# EAGLE design tiny_stella (EAGLE 9.1.3)
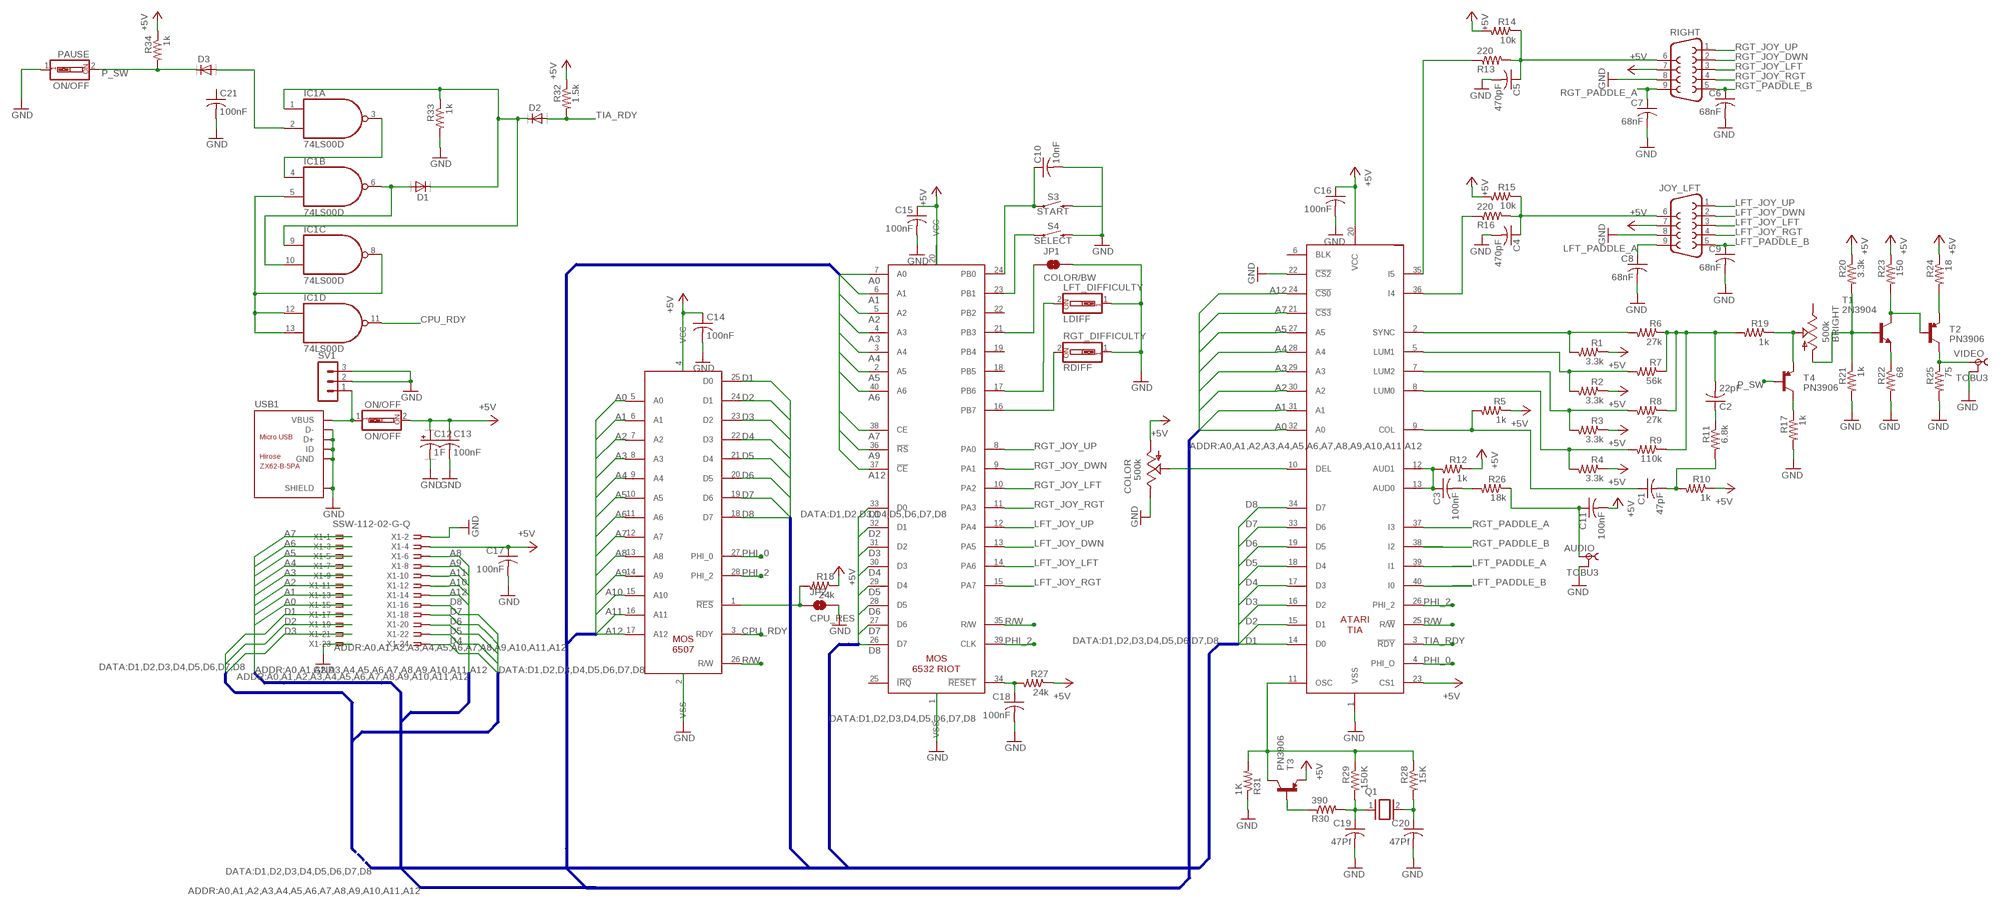
[diagram p0: schematic, sheet 1]

## Parts
6507  MOS_6507  [DIL28]
6532  MOS_6532  [DIL40]
AUDIO  TOBU3  [TOBU3]
BRIGHT  500k  TRIM_US-3223G  [3223G]
C1  47pF  C-USC0805  [C0805]
C2  22pF  C-USC0805  [C0805]
C3  100nF  C-USC0805  [C0805]
C4  470pF  C-USC0805  [C0805]
C5  470pF  C-USC0805  [C0805]
C6  68nF  C-USC0805  [C0805]
C7  68nF  C-USC0805  [C0805]
C8  68nF  C-USC0805  [C0805]
C9  68nF  C-USC0805  [C0805]
C10  10nF  C-USC0805  [C0805]
C11  100nF  C-USC0805  [C0805]
C12  1F  CPOL-USE3.5-8  [E3,5-8]
C13  100nF  C-USC0805  [C0805]
C14  100nF  C-USC0805  [C0805]
C15  100nF  C-USC0805  [C0805]
C16  100nF  C-USC0805  [C0805]
C17  100nF  C-USC0805  [C0805]
C18  100nF  C-USC0805  [C0805]
C19  47Pf  C-USC0805  [C0805]
C20  47Pf  C-USC0805  [C0805]
C21  100nF  C-USC0805  [C0805]
COLOR  500k  TRIM_US-3223G  [3223G]
D1  DIODE_E-  [DIODE_SMB]
D2  DIODE_E-  [DIODE_SMB]
D3  DIODE_E-  [DIODE_SMB]
IC1  74LS00D  [SO14]
JOY_LFT  F09HP  [F09HP]
JP1  COLOR/BW  JUMPER-SMT_2_NO_NO-SILK  [SMT-JUMPER_2_NO_NO-SILK]
JP2  CPU_RES  JUMPER-SMT_2_NO_NO-SILK  [SMT-JUMPER_2_NO_NO-SILK]
LDIFF  LFT_DIFFICULTY  SW_DIP-1  [EDG-01]
ON/OFF  ON/OFF  SW_DIP-1  [EDG-01]
PAUSE  ON/OFF  SW_DIP-1  [EDG-01]
Q1  XTAL/S  [QS]
R1  3.3k  R-US_M0805  [M0805]
R2  3.3k  R-US_M0805  [M0805]
R3  3.3k  R-US_M0805  [M0805]
R4  3.3k  R-US_M0805  [M0805]
R5  1k  R-US_M0805  [M0805]
R6  27k  R-US_M0805  [M0805]
R7  56k  R-US_M0805  [M0805]
R8  27k  R-US_M0805  [M0805]
R9  110k  R-US_M0805  [M0805]
R10  1k  R-US_M0805  [M0805]
R11  6.8k  R-US_M0805  [M0805]
R12  1k  R-US_M0805  [M0805]
R13  220  R-US_M0805  [M0805]
R14  10k  R-US_M0805  [M0805]
R15  10k  R-US_M0805  [M0805]
R16  220  R-US_M0805  [M0805]
R17  1k  R-US_M0805  [M0805]
R18  24k  R-US_M0805  [M0805]
R19  1k  R-US_M0805  [M0805]
R20  3.3k  R-US_M0805  [M0805]
R21  1k  R-US_M0805  [M0805]
R22  68  R-US_M0805  [M0805]
R23  150  R-US_M0805  [M0805]
R24  18  R-US_M0805  [M0805]
R25  75  R-US_M0805  [M0805]
R26  18k  R-US_M0805  [M0805]
R27  24k  R-US_M0805  [M0805]
R28  15K  R-US_M0805  [M0805]
R29  150K  R-US_M0805  [M0805]
R30  390  R-US_M0805  [M0805]
R31  1K  R-US_M0805  [M0805]
R32  1.5k  R-US_M0805  [M0805]
R33  1k  R-US_M0805  [M0805]
R34  1k  R-US_M0805  [M0805]
RDIFF  RGT_DIFFICULTY  SW_DIP-1  [EDG-01]
RIGHT  F09HP  [F09HP]
S3  START  MOMENTARY-SWITCH-SPST-PTH-6.0MM-KIT  [TACTILE_SWITCH_PTH_6.0MM_KIT]
S4  SELECT  MOMENTARY-SWITCH-SPST-PTH-6.0MM-KIT  [TACTILE_SWITCH_PTH_6.0MM_KIT]
SV1  MA03-1  [MA03-1]
T1  2N3904  MMBT3904LT1-NPN-SOT23-BEC  [SOT23-BEC]
T2  PN3906  TRANSISTOR_PNPPMBT3906  [SOT23-3]
T3  PN3906  TRANSISTOR_PNPPMBT3906  [SOT23-3]
T4  PN3906  TRANSISTOR_PNPPMBT3906  [SOT23-3]
TIA  ATARI_TIA  [DIL40]
USB1  ZX62-B-5PA  MICRO-USB-SMD(ZX62-B-5PA)  [MICRO-USB5+6P-SMD-0.65-AB]
VIDEO  TOBU3  [TOBU3]
X1  SSW-112-02-G-Q  [SSW-112-02-G-Q]

## Nets
+5V: 6507.4(VCC) 6532.20(VCC) C11.2 C12.+ C13.1 C14.1 C15.1 C16.1 C17.1 COLOR.1(A) JOY_LFT.7 ON/OFF.2 R1.1 R2.1 R3.1 R4.1 R5.1 R10.1 R12.1 R14.2 R15.2 R18.1 R20.1 R23.1 R24.1 R27.1 R32.1 R34.1 RIGHT.7 T3.2(E) TIA.20(VCC) TIA.23(CS1) X1.4
A0: 6507.5(A0) 6532.7(A0) TIA.32(A0) X1.15
A1: 6507.6(A1) 6532.6(A1) TIA.31(A1) X1.13
A2: 6507.7(A2) 6532.5(A2) TIA.30(A2) X1.11
A3: 6507.8(A3) 6532.4(A3) TIA.29(A3) X1.9
A4: 6507.9(A4) 6532.3(A4) TIA.28(A4) X1.7
A5: 6507.10(A5) 6532.2(A5) TIA.27(A5) X1.5
A6: 6507.11(A6) 6532.40(A6) X1.3
A7: 6507.12(A7) 6532.38(CE) TIA.21(!CS3) X1.1
A8: 6507.13(A8) X1.6
A9: 6507.14(A9) 6532.36(!RS) X1.8
A10: 6507.15(A10) X1.12
A11: 6507.16(A11) X1.10
A12: 6507.17(A12) 6532.37(!CE) TIA.24(!CS0) X1.14
CPU_RDY: 6507.3(RDY) IC1.11(D:O)
D1: 6507.25(D0) 6532.33(D0) TIA.14(D0) X1.17
D2: 6507.24(D1) 6532.32(D1) TIA.15(D1) X1.19
D3: 6507.23(D2) 6532.31(D2) TIA.16(D2) X1.21
D4: 6507.22(D3) 6532.30(D3) TIA.17(D3) X1.24
D5: 6507.21(D4) 6532.29(D4) TIA.18(D4) X1.22
D6: 6507.20(D5) 6532.28(D5) TIA.19(D5) X1.20
D7: 6507.19(D6) 6532.27(D6) TIA.33(D6) X1.18
D8: 6507.18(D7) 6532.26(D7) TIA.34(D7) X1.16
GND: 6507.2(VSS) 6532.1(VSS) AUDIO.2 AUDIO.2@1 AUDIO.2@2 C4.2 C5.2 C6.2 C7.2 C8.2 C9.2 C10.2 C12.- C13.2 C14.2 C15.2 C16.2 C17.2 C18.2 C19.2 C20.2 C21.2 COLOR.3(E) JOY_LFT.8 JP1.2 JP2.2 LDIFF.1 PAUSE.1 R17.2 R21.2 R22.2 R25.2 R31.1 R33.2 RDIFF.1 RIGHT.8 S3.3 S4.3 SV1.2 SV1.3 TIA.1(VSS) TIA.22(!CS2) USB1.2(D-) USB1.3(D+) USB1.4(ID) USB1.5(GND) USB1.P1(SHIELD) USB1.P2(SHIELD) USB1.P3(SHIELD) USB1.P4(SHIELD) USB1.P5(SHIELD) USB1.P6(SHIELD) VIDEO.2 VIDEO.2@1 VIDEO.2@2 X1.2 X1.23
LFT_JOY_DWN: 6532.13(PA5) JOY_LFT.2
LFT_JOY_LFT: 6532.14(PA6) JOY_LFT.3
LFT_JOY_RGT: 6532.15(PA7) JOY_LFT.4
LFT_JOY_UP: 6532.12(PA4) JOY_LFT.1
LFT_PADDLE_A: C8.1 JOY_LFT.9 TIA.39(I1)
LFT_PADDLE_B: C9.1 JOY_LFT.5 TIA.40(I0)
N$1: R1.2 R6.2 TIA.2(SYNC)
N$2: R2.2 R7.2 TIA.5(LUM1)
N$3: R3.2 R8.2 TIA.7(LUM2)
N$4: R4.2 R9.2 TIA.8(LUM0)
N$5: C1.1 R5.2 TIA.9(COL)
N$6: C1.2 R10.2 R11.2
N$7: C2.1 R11.1
N$8: C2.2 R6.1 R7.1 R8.1 R9.1 R19.2
N$9: C5.1 R13.2 R14.1 RIGHT.6
N$10: C4.1 JOY_LFT.6 R15.1 R16.2
N$11: R16.1 TIA.36(I4)
N$12: R13.1 TIA.35(I5)
N$13: BRIGHT.2(S) R19.1 T4.2(E)
N$14: BRIGHT.1(A) R20.2 R21.1 T1.B
N$15: R22.1 T1.E
N$16: R23.2 T1.C T2.1(B)
N$17: COLOR.2(S) TIA.10(DEL)
N$18: 6532.24(PB0) C10.1 S3.1
N$19: 6532.23(PB1) S4.1
N$20: 6532.21(PB3) JP1.1
N$21: 6532.17(PB6) LDIFF.2
N$22: 6532.16(PB7) RDIFF.2
N$23: 6507.1(!RES) JP2.1 R18.2
N$24: R24.2 T2.2(E)
N$25: R25.1 T2.3(C) VIDEO.1
N$26: C3.2 R26.2
N$27: C3.1 R12.2 TIA.12(AUD1) TIA.13(AUD0)
N$28: AUDIO.1 C11.1 R26.1
N$29: 6532.34(!RESET) C18.1 R27.2
N$30: C20.1 Q1.2 R28.2
N$31: C19.1 Q1.1 R29.2 R30.2
N$32: R28.1 R29.1 R31.2 T3.3(C) TIA.11(OSC)
N$33: R30.1 T3.1(B)
N$34: R17.1 T4.3(C)
N$35: IC1.5(B:I1) IC1.8(C:O) IC1.12(D:I0) IC1.13(D:I1)
N$36: D3.A(C) IC1.2(A:I1)
N$38: IC1.3(A:O) IC1.4(B:I0)
N$39: D1.A(C) IC1.6(B:O) IC1.10(C:I1)
N$40: D1.C(A) D2.C(A) IC1.1(A:I0) IC1.9(C:I0) R33.1
P_SW: D3.C(A) PAUSE.2 R34.2 T4.1(B)
PHI_0: 6507.27(PHI_0) TIA.4(PHI_O)
PHI_2: 6507.28(PHI_2) 6532.39(CLK) TIA.26(PHI_2)
R/W: 6507.26(R/W) 6532.35(R/W) TIA.25(R/!W)
RGT_JOY_DWN: 6532.9(PA1) RIGHT.2
RGT_JOY_LFT: 6532.10(PA2) RIGHT.3
RGT_JOY_RGT: 6532.11(PA3) RIGHT.4
RGT_JOY_UP: 6532.8(PA0) RIGHT.1
RGT_PADDLE_A: C7.1 RIGHT.9 TIA.37(I3)
RGT_PADDLE_B: C6.1 RIGHT.5 TIA.38(I2)
TIA_RDY: D2.A(C) R32.2 TIA.3(!RDY)
VBUS: ON/OFF.1 SV1.1 USB1.1(VBUS)
Unconnected: 6532.18(PB5) 6532.19(PB4) 6532.22(PB2) 6532.25(!IRQ) BRIGHT.3(E) C21.1 TIA.6(BLK)

## Buses
DATA:D1,D2,D3,D4,D5,D6,D7,D8
ADDR:A0,A1,A2,A3,A4,A5,A6,A7,A8,A9,A10,A11,A12

## Power pins joined to a net without a drawn wire
GND: IC1.7(P:GND)
VCC: IC1.14(P:VCC)

## Library data of the parts
6507 = tiny_stella:MOS_6507
6532 = tiny_stella:MOS_6532
AUDIO VIDEO = con-hirschmann:TOBU3: Female Cinch CONNECTOR ( RCA Jack ); MF: FARNELL; MPN: TOBU 3; OC_FARNELL: 592791; OC_NEWARK: 06WX5914
BRIGHT COLOR = pot:TRIM_US-: POTENTIOMETER
C1-C11 C13-C21 = resistor:C-US: CAPACITOR, American symbol
C12 = resistor:CPOL-US: POLARIZED CAPACITOR, American symbol
D1-D3 = eagle-ltspice:DIODE_E-: Schottky Diode; SPICEMODEL: diode; SPICEPREFIX: D
IC1 = 74xx-us:74*00: Quad 2-input NAND gate
JOY_LFT RIGHT = con-subd:F09: SUB-D; OC_FARNELL: unknown; OC_NEWARK: unknown
JP1 JP2 = SparkFun-Jumpers:JUMPER-SMT_2_NO: Normally open jumper This jumper has two pads in close proximity to each other. Apply solder to close the connection. Round pads are easier to solder for beginners, but are a lot larger. SparkFun Product that uses the round pads: SparkFun EL Sequencer <https://www.sparkfun.com/products/12781>
LDIFF ON/OFF PAUSE RDIFF = special:SW_DIP-1: DIP SWITCH
Q1 = special:XTAL/S: CRYSTAL
R1-R34 = resistor:R-US_: RESISTOR, American symbol
S3 S4 = SparkFun-Switches:MOMENTARY-SWITCH-SPST: Momentary Switch (Pushbutton) - SPST Normally-open (NO) SPST momentary switches (buttons, pushbuttons). Variants PTH-12MM - 12mm square, through-hole Momentary Pushbutton Switch - 12mm Square <https://www.sparkfun.com/products/9190> (COM-09190) PTH-6.0MM, PTH-6.0MM-KIT - 6.0mm square, through-hole Mini Pushbutton Switch <https://www.sparkfun.com/products/97> (COM-00097) KIT package intended for soldering kit's - only one side of pads' copper is exposed. PTH-RIGHT-ANGLE-KIT - Right-angle, through-hole Right Angle Tactile Button <https://www.sparkfun.com/products/10791> - Used on SparkFun BigTime Watch Kit <https://www.sparkfun.com/products/11734> SMD-12MM - 12mm square, surface-mount Tactile Button - SMD (12mm) <https://www.sparkfun.com/products/12993> (COM-12993) Used on SparkFun PicoBoard <https://www.sparkfun.com/products/11888> SMD-4.5MM - 4.5mm Square Trackball Switch Used on SparkFun Blackberry Trackballer Breakout <https://www.sparkfun.com/products/13169> SMD-4.6MMX2.8MM - 4.60mm x 2.80mm, surface mount Used on SparkFun SAMD21 Mini Breakout <https://www.sparkfun.com/products/13664> SMD-5.2MM, SMD-5.2-REDUNDANT - 5.2mm square, surface-mount Mini Pushbutton Switch - SMD <https://www.sparkfun.com/products/8720> (COM-08720) Used on Arduino Pro Mini <https://www.sparkfun.com/products/11114> REDUNDANT package connects both switch circuits together SMD-6.0X3.5MM - 6.0 x 3.5mm, surface mount Momentary Reset Switch SMD <https://www.sparkfun.com/products/8229> (COM-08229) SMD-6.2MM-TALL - 6.2mm square, surface mount Tactile Button - SMD (6mm) <https://www.sparkfun.com/products/12992> Used on SparkFun Digital Sandbox <https://www.sparkfun.com/products/12651> SMD-RIGHT-ANGLE - Right-angle, surface mount Used on SparkFun Block for Intel® Edison - Arduino <https://www.sparkfun.com/products/13036>; PROD_ID: SWCH-08441; SF_SKU: COM-00097
SV1 = con-lstb:MA03-1: PIN HEADER; OC_FARNELL: unknown; OC_NEWARK: unknown
T1 = transistor:*-NPN-: NPN Transistror BF959 corrected 2008.03.06
T2-T4 = User-Submitted:TRANSISTOR_PNP: Generic PNP BJT Double check pinouts against datasheets- not all devices are the same! MMBT3906 - 40V 200mA SOT-23 (TRANS-08052) MMBT4403 - 40V 600mA SOT-23 (TRANS-09245); PROD_ID: TRANS-08052; VALUE: PMBT3906
TIA = tiny_stella:ATARI_TIA
USB1 = Seeed-Connector:MICRO-USB-SMD(ZX62-B-5PA): 320010005; MPN: ZX62-B-5PA
X1 = con-samtec:SSW-112-02-G: THROUGH-HOLE .025" SQ POST SOCKET Source: Samtec SSW.pdf; MF: Samtec Inc.; MPN: SSW-112-02-G-Q

## Board
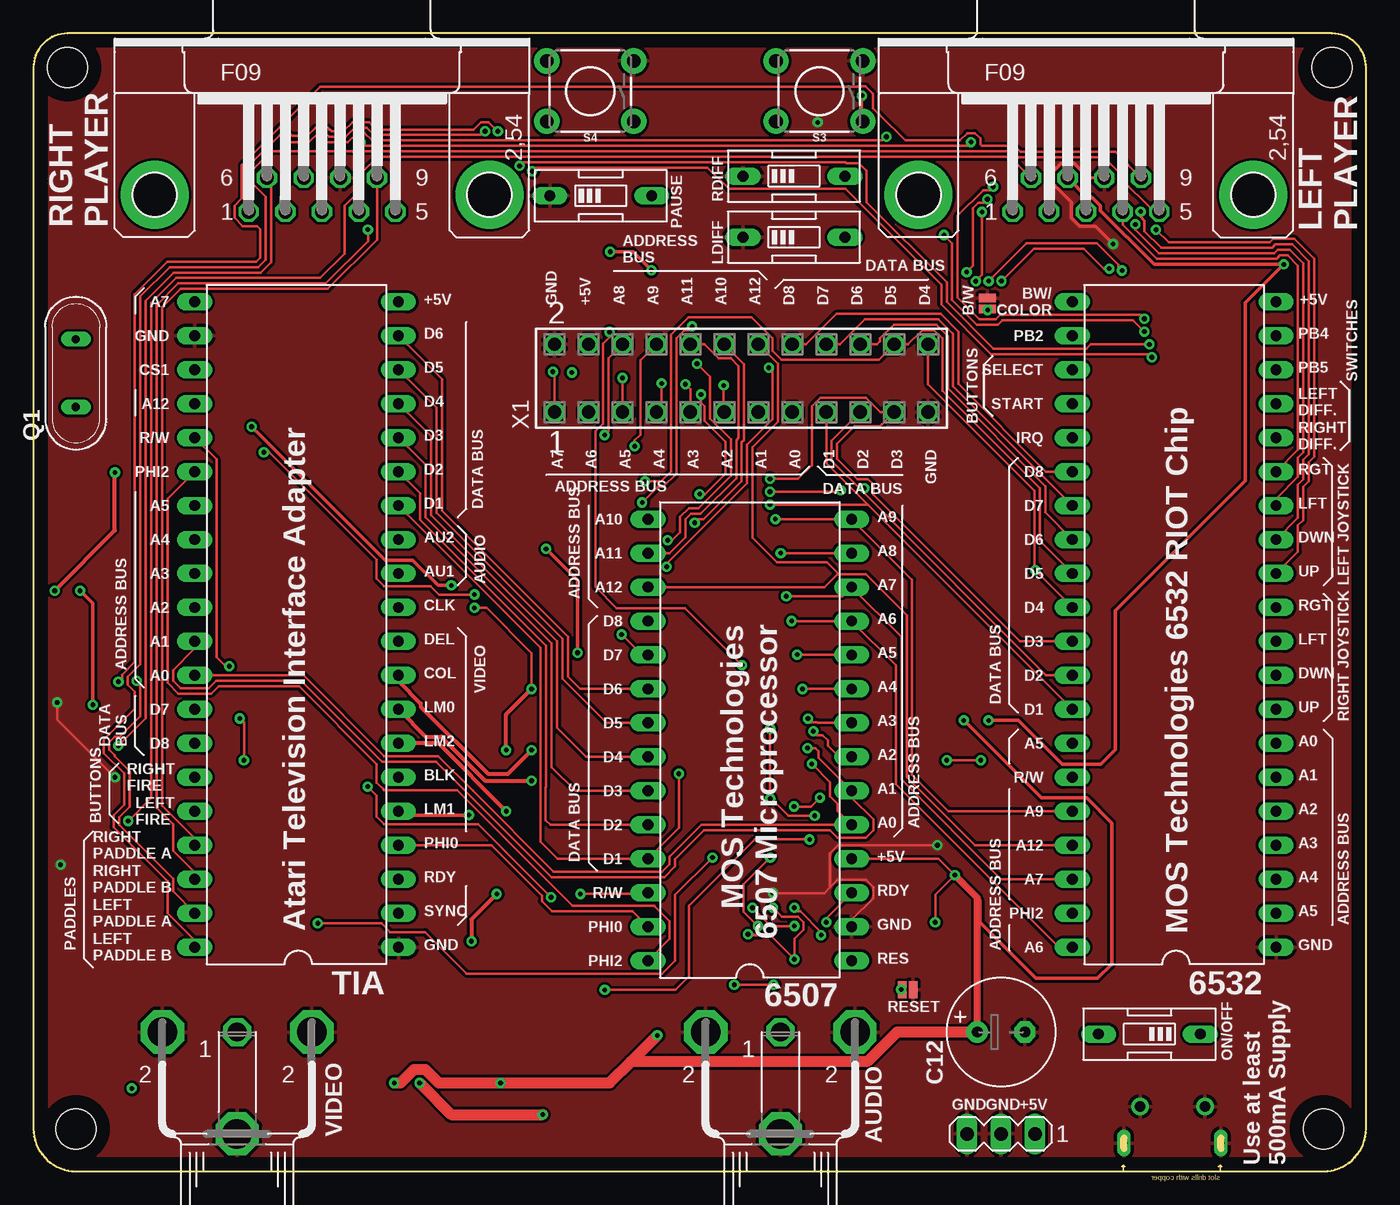
[diagram p1: board, top side]
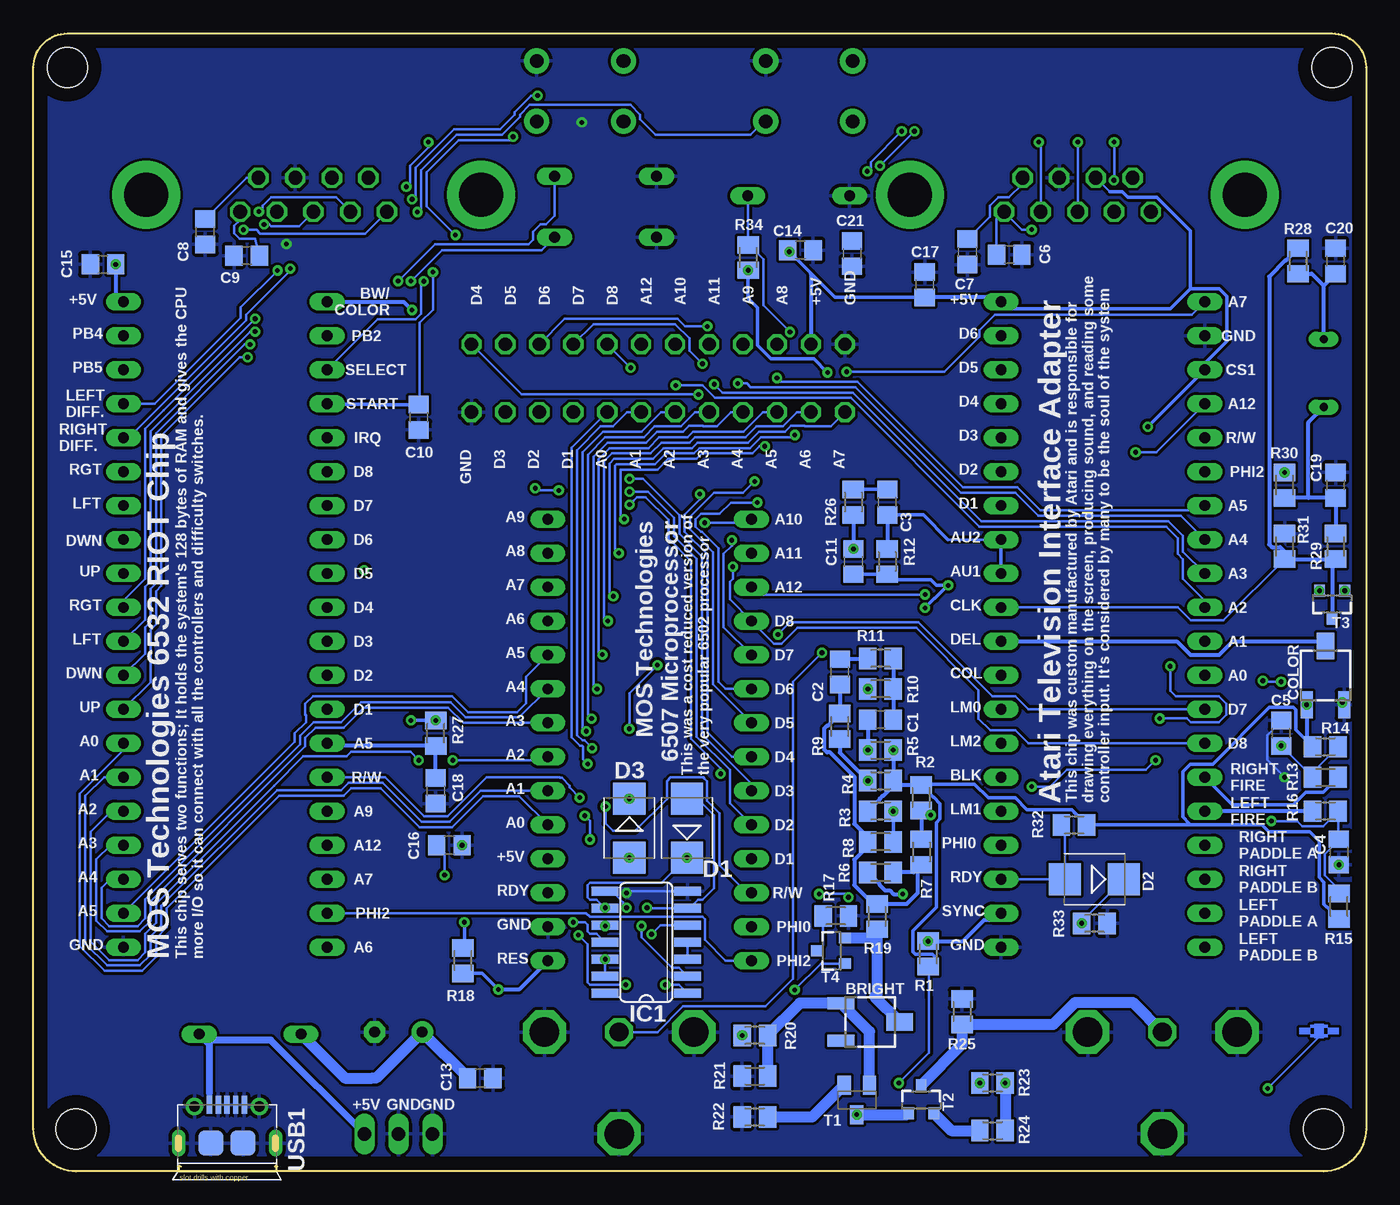
[diagram p2: board, bottom side, seen from below]

Size 99.69 x 85.09 mm. Coordinates in mm from the lower left corner, seen from the top.
Outline: 0,82.55 0,3.17
Outline: 0,3.17 arc90 3.17,0 96.52,0 arc90 99.69,3.17 99.69,82.55 arc90 97.16,85.09 2.54,85.09 arc90 0,82.55
Outline: 0,82.55 0,3.17
Copper layers (1*16): Top 0.035mm / dielectric 1.5mm / Bottom 0.035mm
Design rules "default *": minimum track width 8mil, minimum drill 0.35mm, track to track 8mil, track to pad 8mil, pad to pad 8mil, via to via 8mil, smd to smd 0mil, copper to edge 40mil, drill to drill 8mil, minimum pad ring 10mil, minimum via ring 8mil, stop-mask expansion 4mil, vias tented up to drill 0mil, thermal gap 10mil
Holes 3 mm at 2.54,82.55 97.16,82.55 96.52,3.17 3.17,3.17

### Footprints (pad centres in the part's own frame; a part is rotated, then mirrored left to right if it is on the bottom)
DIL28 = drill 0.813 long: 1 -16.51,-7.62; 2 -13.97,-7.62; 3 -11.43,-7.62; 4 -8.89,-7.62; 5 -6.35,-7.62; 6 -3.81,-7.62; 7 -1.27,-7.62; 8 1.27,-7.62; 9 3.81,-7.62; 10 6.35,-7.62; 11 8.89,-7.62; 12 11.43,-7.62; 13 13.97,-7.62; 14 16.51,-7.62; 15 16.51,7.62; 16 13.97,7.62; 17 11.43,7.62; 18 8.89,7.62; 19 6.35,7.62; 20 3.81,7.62; 21 1.27,7.62; 22 -1.27,7.62; 23 -3.81,7.62; 24 -6.35,7.62; 25 -8.89,7.62; 26 -11.43,7.62; 27 -13.97,7.62; 28 -16.51,7.62
DIL40 = drill 0.813 long: 1 -24.13,-7.62; 2 -21.59,-7.62; 3 -19.05,-7.62; 4 -16.51,-7.62; 5 -13.97,-7.62; 6 -11.43,-7.62; 7 -8.89,-7.62; 8 -6.35,-7.62; 9 -3.81,-7.62; 10 -1.27,-7.62; 11 1.27,-7.62; 12 3.81,-7.62; 13 6.35,-7.62; 14 8.89,-7.62; 15 11.43,-7.62; 16 13.97,-7.62; 17 16.51,-7.62; 18 19.05,-7.62; 19 21.59,-7.62; 20 24.13,-7.62; 21 24.13,7.62; 22 21.59,7.62; 23 19.05,7.62; 24 16.51,7.62; 25 13.97,7.62; 26 11.43,7.62; 27 8.89,7.62; 28 6.35,7.62; 29 3.81,7.62; 30 1.27,7.62; 31 -1.27,7.62; 32 -3.81,7.62; 33 -6.35,7.62; 34 -8.89,7.62; 35 -11.43,7.62; 36 -13.97,7.62; 37 -16.51,7.62; 38 -19.05,7.62; 39 -21.59,7.62; 40 -24.13,7.62
TOBU3 = drill 1.397 octagon: 1 0,-2.54 | drill 2.21 octagon: 2 5.588,-2.54; 2@1 -5.588,-2.54; 2@2 0,5.08
3223G = smd 2 x 0.9: 1 -2.2,1.4; 3 -2.2,-1.4 | smd 2 x 1.3: 2 2.2,0
C0805 = smd 1.3 x 1.5: 1 -0.95,0; 2 0.95,0
E3,5-8 = drill 0.813 pad 1.6: + -1.778,0 | drill 0.813 pad 1.6 octagon: - 1.778,0
DIODE_SMB = smd 2.4 x 2.4: A 2.2,0; C -2.2,0
SO14 = smd 0.66 x 2.032: 1 -3.81,-3.073; 2 -2.54,-3.073; 3 -1.27,-3.073; 4 0,-3.073; 5 1.27,-3.073; 6 2.54,-3.073; 7 3.81,-3.073; 8 3.81,3.073; 9 2.54,3.073; 10 1.27,3.073; 11 0,3.073; 12 -1.27,3.073; 13 -2.54,3.073; 14 -3.81,3.073
F09HP = drill 1.016 octagon: 1 -5.486,-1.27; 2 -2.743,-1.27; 3 0,-1.27; 4 2.743,-1.27; 5 5.486,-1.27; 6 -4.115,1.27; 7 -1.372,1.27; 8 1.372,1.27; 9 4.115,1.27 | drill 3.302 pad 5.08: G1 -12.522,0; G2 12.522,0
SMT-JUMPER_2_NO_NO-SILK = smd 0.635 x 1.27: 1 -0.406,0; 2 0.406,0
EDG-01 = drill 0.813 long: 1 0,-3.81; 2 0,3.81
QS = drill 0.61 long: 1 -2.54,0; 2 2.54,0
M0805 = smd 1.3 x 1.6: 1 -0.95,0; 2 0.95,0
TACTILE_SWITCH_PTH_6.0MM_KIT = drill 1.016 pad 1.88: 1 -3.251,2.261; 2 3.251,2.261; 3 -3.251,-2.261; 4 3.251,-2.261
MA03-1 = drill 1.016 long: 1 -2.54,0; 2 0,0; 3 2.54,0
SOT23-BEC = smd 1 x 1.4: B -0.95,-1.1; C 0,1.1; E 0.95,-1.1
SOT23-3 = smd 0.8 x 0.9: 1 -0.95,-1; 2 0.95,-1; 3 0,1.1
MICRO-USB5+6P-SMD-0.65-AB = smd 0.4 x 1.35: 1 -1.3,2.875; 2 -0.65,2.875; 3 0,2.875; 4 0.65,2.875; 5 1.3,2.875 | smd 1.9 x 1.9: P1 -1.2,0; P2 1.2,0 | drill 0.508 pad 1.016 long: P3 -3.625,0; P4 3.625,0 | drill 0.8: P5 -2.425,2.73; P6 2.425,2.73
SSW-112-02-G-Q = drill 1 pad 1.5 octagon: 1 -13.97,-2.54; 2 -13.97,2.54; 3 -11.43,-2.54; 4 -11.43,2.54; 5 -8.89,-2.54; 6 -8.89,2.54; 7 -6.35,-2.54; 8 -6.35,2.54; 9 -3.81,-2.54; 10 -3.81,2.54; 11 -1.27,-2.54; 12 -1.27,2.54; 13 1.27,-2.54; 14 1.27,2.54; 15 3.81,-2.54; 16 3.81,2.54; 17 6.35,-2.54; 18 6.35,2.54; 19 8.89,-2.54; 20 8.89,2.54; 21 11.43,-2.54; 22 11.43,2.54; 23 13.97,-2.54; 24 13.97,2.54

### Placement (x,y rotation side)
6507  53.59,32.26 90 top
6532  85.34,40.89 90 top
AUDIO  55.88,7.87 180 top
BRIGHT  37.08,11.18 0 bottom
C1  36.32,33.78 0 bottom
C2  39.37,37.34 270 bottom
C3  35.81,50.04 90 bottom
C4  2.03,23.88 270 bottom
C5  6.35,32.77 90 bottom
C6  26.7,68.55 0 bottom
C7  29.82,68.76 270 bottom
C8  86.84,70.26 270 bottom
C9  83.74,68.48 180 bottom
C10  70.87,56.39 270 bottom
C11  38.35,45.59 270 bottom
C12  72.39,10.41 0 top
C13  66.27,6.96 0 bottom
C14  42.32,68.88 0 bottom
C15  94.49,67.82 180 bottom
C16  68.58,24.38 0 bottom
C17  33.02,66.29 90 bottom
C18  69.6,28.45 270 bottom
C19  2.29,51.31 90 bottom
C20  2.29,68.07 90 bottom
C21  38.46,68.63 270 bottom
COLOR  3.05,37.08 90 bottom
D1  50.8,25.65 90 bottom
D2  20.32,21.84 180 bottom
D3  55.12,25.65 270 bottom
IC1  53.85,17.12 90 bottom
JOY_LFT  78.74,73.03 0 top
JP1  71.37,64.9 90 top
JP2  65.41,13.59 0 top
LDIFF  56.9,69.85 270 top
ON/OFF  83.49,10.26 90 top
PAUSE  42.44,72.95 270 top
Q1  3.17,59.69 90 top
R1  32.77,16.26 90 bottom
R2  33.27,27.94 270 bottom
R3  36.32,26.92 0 bottom
R4  36.32,29.21 180 bottom
R5  36.32,31.5 180 bottom
R6  36.32,22.35 180 bottom
R7  33.27,23.88 90 bottom
R8  36.32,24.64 0 bottom
R9  39.37,33.27 270 bottom
R10  36.32,36.07 0 bottom
R11  36.32,38.35 0 bottom
R12  35.81,45.59 90 bottom
R13  3.05,29.46 180 bottom
R14  3.05,31.75 180 bottom
R15  2.03,19.81 270 bottom
R16  3.05,26.92 0 bottom
R17  39.67,19.1 0 bottom
R18  67.56,15.75 270 bottom
R19  36.58,19.05 90 bottom
R20  45.72,10.16 0 bottom
R21  45.72,7.11 180 bottom
R22  45.72,4.06 180 bottom
R23  27.94,6.6 180 bottom
R24  27.94,3.05 180 bottom
R25  30.23,11.94 90 bottom
R26  38.35,50.04 90 bottom
R27  69.6,32.77 270 bottom
R28  5.08,68.07 270 bottom
R29  2.29,46.74 90 bottom
R30  6.1,51.31 270 bottom
R31  6.1,46.74 270 bottom
R32  21.84,25.91 180 bottom
R33  20.32,18.54 0 bottom
R34  46.23,68.33 90 bottom
RDIFF  56.9,74.42 270 top
RIGHT  21.59,73.03 0 top
S3  58.8,80.77 180 top
S4  41.66,80.77 180 top
SV1  72.39,2.79 180 top
T1  38.1,5.33 180 bottom
T2  33.27,5.33 0 bottom
T3  2.54,42.42 180 bottom
T4  39.98,16.48 90 bottom
TIA  19.68,40.89 90 top
USB1  85.22,2.11 0 bottom
VIDEO  15.24,7.87 180 top
X1  52.96,59.31 0 top

### Tracks (layer width: path | path; a pad name or v marks a point on that pad's centre or on a via)
+5V  (via drill 0.35)
  Top 0.203: 6507.4 67.72,23.37 68.9,22.19 v68.94,22.15 67.46,20.68 v67.46,18.62 | R10.1 37.27,38.75 33.89,42.13 v32.99,42.13
  Top 0.254: T3.2 4.45,42.46 COLOR.1 | 69.55,33.77 R27.1 75.4,27.91 78.8,27.91 80.67,26.04 80.67,15.49 79.6,14.43 74.98,14.43 70.8,18.61 70.8,20.28 70.61,20.47 | v43.15,68.77 44.84,68.77 R34.1 | v16.33,55.68 26.31,45.7 28.38,45.7 30.26,43.81 v31.27,43.81 | JOY_LFT.7 78.82,72.85 79.19,72.85 79.83,72.21 79.83,71.83 83.84,67.82 C15.1 90.66,64.94 90.66,51.64 80.94,41.92 80.94,31.51 79.86,30.43 78.82,30.43 78.8,30.45 76.96,30.45 73.7,33.72 v71.45,33.72
  Top 0.305: R5.1 35.37,34.17 R10.1
  Top 0.508: C12.+ 70.61,20.47 68.9,22.19
  Top 0.813: 44.7,8.19 R20.1 | R23.1 27.45,6.6 28.47,7.62 29.31,7.62 30.33,6.6 v34.95,6.6 43.11,6.6 44.7,8.19 | C12.+ 64.61,10.41 62.39,8.19 44.7,8.19
  Bottom 0.203: 32.7,12.98 32.7,12.95 | 32.7,12.95 32.7,8.85 v34.95,6.6 | v68.94,22.15 68.94,23.79 C16.1 | v67.45,18.62 v67.46,18.62 | 19.18,73.25 RIGHT.7 | 32.7,12.95 32.7,15.24 R1.1 | C14.1 v43.15,68.77
  Bottom 0.254: 20.88,25.91 R32.1 21.81,26.83 21.81,26.84 | 20.88,25.91 13.21,25.91 | 13.21,25.91 7.81,25.91 7.29,25.39 4.22,25.39 3.51,24.68 3.51,23.89 3.52,23.88 3.52,21.97 3.16,21.61 3.16,19.98 2.97,19.78 2.95,19.78 R15.2 | 21.81,26.84 22.01,27.04 24.97,27.04 25.36,27.04 26.23,27.91 28.27,27.91 29.31,28.96 33.21,28.96 R2.1 32.35,27.97 32.34,27.97 31.86,27.5 31.86,26.35 32.14,26.07 32.14,19.75 33.9,17.99 33.9,16.42 33.7,16.23 32.44,16.23 32.14,15.93 R1.1 | 21.81,26.84 20.88,25.91 | TIA.20 27.28,65.02 26.75,64.49 14.66,64.49 13.14,66.02 | 13.14,66.02 10.99,66.02 10.41,65.43 10.41,62.07 12.06,60.42 TIA.23 v16.33,55.68 | 19.18,73.25 18.23,73.25 17.82,72.85 15.65,72.85 13.14,70.33 13.14,66.02 | C17.1 39.73,65.34 41.53,67.15 v43.15,68.77 | v40.28,59.73 41.32,60.77 44.52,60.77 45.52,61.76 45.52,64.58 46.23,65.29 R34.1 | v32.99,42.13 32.29,42.84 32.24,42.84 v31.27,43.81 32.13,43.81 32.54,44.22 35.39,44.22 R12.1 C11.2 | v71.45,33.72 R27.1 | 13.21,25.91 13.21,26.01 13.72,26.51 13.72,29.87 13.14,30.45 11.48,30.45 7.24,34.7 5.46,34.7 5.27,34.5 5.27,33.02 R14.2 | R18.1 67.45,16.81 v67.45,18.62
  Bottom 0.305: R5.1 R4.1 | R4.1 35.37,28.82 | COLOR.1 4.45,32.2 R14.2 | TIA.20 27.62,65.34 C17.1 | C15.1 93.54,65.6 6532.20 | 41.53,67.15 X1.4 | R4.1 35.05,28.89 R2.1 | R4.1 35.37,28.82 | 35.37,28.82 36.12,28.08 36.17,28.08 36.38,27.87 36.38,27.82 R3.1
  Bottom 0.508: ON/OFF.2 79.62,10.32
  Bottom 0.813: R23.1 R24.1 | ON/OFF.2 76.38,6.96 74.35,6.96 74.07,6.96 C12.+ 67.22,7.02 C13.1
  other vias: 35.37,31.5 37.27,36.07 3.49,43.42 4.45,34.88 26.99,6.6 46.67,10.16 93.54,67.82 69.6,33.72 46.23,67.38
A0  (via drill 0.35)
  Top 0.203: v58.23,30.47 59.59,29.11 59.59,28.05 60.15,27.48 60.15,26.97 6507.5 49.99,25.91 47.6,23.52 47.6,22.97 47.03,22.4 38.93,22.4 32.88,28.45 30.29,31.04 26.25,31.04 20.2,37.08 TIA.32
  Bottom 0.203: 6532.7 92.96,31.49 96.22,28.24 96.22,16.84 94.36,14.99 91.57,14.99 90.53,16.03 90.53,17.42 89.71,18.23 89.71,19.68 81.3,28.09 76.5,28.09 75.94,28.65 73.73,28.65 70.81,25.73 68.38,25.73 66.07,28.04 63.35,28.04 6507.5 | X1.15 59.44,54.1 59.44,32.45 58.8,31.81 58.65,31.81 58.59,31.76 58.59,30.83 v58.23,30.47
A1  (via drill 0.35)
  Top 0.203: TIA.31 12.06,39.11 10.44,37.48 10.44,36.68 11.01,36.12 13.12,36.12 13.68,36.68 20.03,36.68 26.08,30.63 30.12,30.63 38.76,22 47.2,22 48.01,22.8 48.01,23.35 50.15,25.49 59.6,25.49 60.15,24.94 62.27,24.94 62.84,25.51 62.84,26.31 61.21,27.93 6507.6 58.74,30.92 58.74,31.42 58.51,31.65 v57.91,31.65
  Bottom 0.203: X1.13 55.27,56.77 56.33,55.71 57.25,55.71 59.03,53.93 59.03,32.62 58.63,32.22 58.48,32.22 v57.91,31.65 | 6507.6 66.24,28.45 68.55,26.14 70.64,26.14 73.56,29.06 76.11,29.06 76.66,28.5 81.47,28.5 90.12,19.85 90.12,18.4 90.93,17.59 90.93,16.2 91.73,15.39 94.19,15.39 95.81,17.01 95.81,28.07 94.42,29.46 6532.6
A2  (via drill 0.35)
  Top 0.203: v70.87,30.73 v68.33,30.73 | 6507.7 60.26,30.99 59.42,31.82 59.42,32.22 59.02,32.62 58.62,32.62 v58.35,32.9 | v51.64,58.77 51.64,56.82 X1.11
  Bottom 0.203: 81.7,28.84 90.53,20.02 90.53,18.57 91.34,17.75 91.34,16.36 91.9,15.8 94.02,15.8 95.4,17.18 95.4,25.4 93.88,26.92 6532.5 | v68.33,30.73 61.47,30.73 6507.7 | v58.35,32.9 58.62,33.18 58.62,53.77 57.09,55.3 54.2,55.3 52.73,56.77 X1.11 | v51.64,58.77 49.66,58.77 48.71,57.83 38.55,57.83 28.93,48.21 14.95,48.21 14.1,47.35 14.1,46.16 13.69,45.76 13.69,44.3 12.06,42.68 TIA.30 | 81.7,28.84 | 81.7,28.84 79.5,31.04 76.25,31.04 75.93,31.36 71.49,31.36 v70.87,30.73
A3  (via drill 0.35)
  Top 0.203: 6507.8 58.68,33.53 58.63,33.58 58.21,33.58 v57.94,33.85 | v48.77,58.86 49.15,58.48 X1.9
  Bottom 0.203: v57.94,33.85 58.22,34.13 58.22,53.6 56.92,54.9 54.03,54.9 53.22,55.71 51.25,55.71 50.19,56.77 X1.9 | v48.77,58.86 48.15,58.23 38.38,58.23 28.76,48.62 14.78,48.62 13.69,47.52 13.69,46.33 TIA.29 | 6507.8 67.53,33.53 68.67,34.67 75,34.67 76.5,33.17 78.58,33.17 79.35,32.4 79.35,31.77 90.93,20.19 90.93,18.74 91.73,17.93 94.19,17.93 95,18.74 95,23.32 93.93,24.38 6532.4
A4  (via drill 0.35)
  Top 0.203: 6507.9 v57.53,36.07 | v47,58.92 47,57.16 X1.7
  Bottom 0.203: X1.7 47.5,56.77 48.56,55.71 49.59,55.71 49.61,55.73 50.65,55.73 51.08,55.3 53.05,55.3 53.86,54.49 56.75,54.49 57.81,53.43 57.81,36.07 v57.53,36.07 | v47,58.92 46.33,58.92 46.05,58.64 38.21,58.64 30.32,50.75 26.25,50.75 24.52,49.02 13.84,49.02 TIA.28 | 6507.9 63.35,33.93 67.36,33.93 68.5,35.08 75.17,35.08 76.66,33.58 78.75,33.58 79.76,32.57 79.76,31.94 91.34,20.36 91.34,18.9 91.9,18.34 94.02,18.34 94.59,18.9 94.59,21.21 93.95,21.84 6532.3
A5  (via drill 0.35)
  Top 0.203: 6507.10 57.15,38.61 v57.13,38.63 | v44.07,59.32 X1.5
  Bottom 0.203: X1.5 45.11,56.77 46.58,55.3 50.36,55.3 50.77,54.9 52.88,54.9 53.69,54.09 56.58,54.09 57.4,53.26 57.4,38.63 v57.13,38.63 | v44.07,59.32 43.79,59.05 38.05,59.05 30.15,51.16 26.08,51.16 24.35,49.43 12.42,49.43 TIA.27 | 6507.10 62.84,36.98 62.84,35.02 63.52,34.34 67.19,34.34 68.36,35.51 78.78,35.51 79.35,34.94 79.35,34.14 79.31,34.11 79.31,33.59 80.16,32.74 80.16,32.11 6532.2
A6  (via drill 0.35)
  Top 0.203: 6532.40 76.71,16.76 64.52,28.96 64.52,37.85 6507.11 v56.72,41.15
  Bottom 0.203: X1.3 42.57,56.77 43.63,55.71 45.6,55.71 46.41,54.9 50.19,54.9 50.6,54.49 52.71,54.49 53.52,53.68 56.41,53.68 57,53.09 57,41.12 56.75,41.12 v56.72,41.15
A7  (via drill 0.35)
  Top 0.203: 6532.38 72.39,21.84 64.92,29.31 64.92,39.98 6507.12 60.53,43.01 v56.31,43.01 | v38.86,59.79 38.99,59.66 X1.1
  Bottom 0.203: v56.31,43.01 56.59,43.28 56.59,52.92 56.24,53.27 53.35,53.27 52.54,54.09 50.43,54.09 50.02,54.49 46.24,54.49 45.43,55.3 43.46,55.3 43.02,55.75 42,55.75 41.97,55.71 40.05,55.71 X1.1 | v38.86,59.79 31.55,59.79 28.93,62.41 28.93,62.88 27.76,64.06 13.03,64.06 TIA.21
A8  (via drill 0.35)
  Top 0.203: 6507.13 v55.91,46.23 | v42.74,55.06 43.01,55.34 43.01,60.79 X1.6
  Bottom 0.203: v55.91,46.23 56.19,46.51 56.19,52.76 56.08,52.87 53.19,52.87 52.37,53.68 50.26,53.68 49.85,54.09 46.07,54.09 45.26,54.9 42.9,54.9 v42.74,55.06
A9  (via drill 0.35)
  Top 0.203: 6532.36 68.46,26.92 65.73,29.65 65.73,44.25 6507.14 v55.5,48.77 | v44.98,54.21 44.98,54.65 45.41,55.09 45.41,60.66 X1.8
  Bottom 0.203: v55.5,48.77 55.78,49.05 55.78,52.46 53.02,52.46 52.21,53.27 50.09,53.27 49.69,53.68 45.9,53.68 45.37,54.21 v44.98,54.21
A10  (via drill 0.35)
  Top 0.203: X1.12 53.17,60.37 53.17,54.69 52.98,54.5 52.98,51.61 50.15,48.77 49.75,48.77 v49.48,48.49
  Bottom 0.203: 6507.15 46.25,48.49 v49.48,48.49
A11
  Top 0.203: 6507.16 47.57,46.23 47.59,46.21 48.79,47.42 48.79,48.77 49.2,49.17 49.91,49.17 52.58,51.84 52.58,54.67 52.76,54.85 52.76,57.48 52.76,58.23 52.76,60.2 52.17,60.79 51.25,60.79 50.19,61.85 X1.10
A12  (via drill 0.35)
  Top 0.203: 6532.37 70.42,24.38 65.33,29.48 65.33,41.6 62.27,44.65 60.25,44.65 | 60.25,44.65 60.15,44.65 59.19,43.69 6507.17 | 60.25,44.65 59.36,45.55 55.62,45.55 53.8,47.37 53.8,54.16 55.7,56.07 55.7,60.38 X1.14 | v32.99,43.13 30.33,43.13 29.72,43.74 26.25,43.74 25.68,44.3 25.68,45.72 17.63,53.77 v17.24,53.77
  Bottom 0.203: v32.99,43.13 45.41,43.13 6507.17 | TIA.24 15.7,53.77 v17.24,53.77
CPU_RDY  (via drill 0.35)
  Top 0.203: v59.31,18.62 59.31,18.93 6507.3
  Bottom 0.203: v59.31,18.62 58.42,18.62 58.24,18.44 58.24,17.93 58.06,17.75 57.56,17.75 IC1.11
D1  (via drill 0.35)
  Top 0.203: 6532.33 62.41,49.86 | 62.41,49.86 59.31,52.96 X1.17 | v48.28,29.73 48.28,25.68 6507.25 39.19,23.37 37.92,24.64 37.92,28.89 37.95,28.93 37.95,39.13 TIA.14 | v55.09,49.86 62.41,49.86
  Bottom 0.203: v48.28,29.73 48.28,30.12 50.49,32.33 50.49,45.63 52.19,47.33 52.19,48.71 53.89,50.41 54.54,50.41 54.81,50.13 54.82,50.13 v55.09,49.86
D2  (via drill 0.35)
  Top 0.203: 6532.32 75.76,37.08 62.15,50.69 | v55.09,50.82 60.29,50.82 v60.39,50.91 | v62.15,51.08 62.15,50.69 | TIA.15 28.93,50.7 28.93,49.38 28.93,48.74 38.36,39.3 38.36,28.76 38.33,28.73 38.33,26.26 38.68,25.91 6507.24 | X1.19 59.72,54.63 59.72,53.13 62.15,50.69
  Bottom 0.203: 6507.24 47.6,27.53 47.6,30.01 50.09,32.5 50.09,45.8 51.79,47.5 51.79,48.88 53.72,50.82 v55.09,50.82 | v60.39,50.91 61.99,50.91 v62.15,51.08
D3  (via drill 0.35)
  Top 0.203: TIA.16 29.34,52.83 29.34,49.22 29.33,49.21 29.33,48.91 38.77,39.47 38.77,30.23 40.55,28.45 6507.23 | 6532.31 73.79,39.62 62.84,50.58 62.84,51.36 62.44,51.76 61.66,51.76 60.12,53.3 60.12,54.42 61.41,55.71 63.33,55.71 63.49,55.87 X1.21 63.35,56.77 62.29,57.83 58.87,57.83 58.25,57.21 58.25,52.81 57.21,51.78 v55.09,51.78
  Bottom 0.203: 6507.23 45.97,28.96 49.68,32.67 49.68,45.97 51.38,47.67 51.38,49.05 54.11,51.78 v55.09,51.78
D4  (via drill 0.35)
  Top 0.203: 6532.30 v74.94,44.95 74.88,45.01 74.88,50.91 66.93,58.85 X1.24 | v49.94,58.09 49.94,57.48 50.21,57.21 50.21,56.13 51.77,54.57 51.77,52.18 50.23,50.64 v49.84,50.64 | TIA.17 29.74,54.97 29.74,49.07 39.17,39.64 39.17,33.16 41.35,30.99 6507.22
  Bottom 0.203: v49.84,50.64 49.84,50.25 50.97,49.11 50.97,47.83 49.27,46.14 49.27,32.84 47.42,30.99 6507.22 | v49.94,58.09 63.17,58.09 X1.24
D5  (via drill 0.35)
  Top 0.203: 6532.29 75.29,47.14 75.29,51.07 67.99,58.37 67.99,62.29 67.37,62.91 66.49,62.91 65.43,61.85 X1.22 63.24,60.7 55.95,60.7 55.29,61.37 55.29,62.29 53.71,63.87 48.99,63.87 47.68,62.56 47.68,52.32 46.95,51.59 v45.74,51.59 | TIA.18 30.15,57.1 30.15,49.24 39.58,39.81 39.58,36.82 42.88,33.53 6507.21
  Bottom 0.203: 6507.21 48.87,36.42 48.87,46.3 50.57,48 50.57,48.94 48.79,50.72 46.61,50.72 v45.74,51.59
D6  (via drill 0.35)
  Top 0.203: X1.20 63.12,61.85 63.33,62.06 63.33,62.29 64.36,63.31 67.54,63.31 68.39,62.46 68.39,58.54 75.69,51.24 75.69,49.28 6532.28 | v49.28,63.18 49,62.91 48.71,62.91 48.09,62.29 48.09,52.16 47.12,51.18 46.71,51.18 v45.54,50.01 | TIA.19 30.56,59.23 30.56,49.41 39.99,39.98 39.99,36.99 40.91,36.07 6507.20
  Bottom 0.203: X1.20 59.94,63.75 51.52,63.75 50.95,63.18 v49.28,63.18 | 6507.20 47.94,36.07 48.46,36.59 48.46,46.58 49.69,47.81 49.76,47.81 50.16,48.21 50.16,48.77 49.76,49.17 48.36,49.17 47.53,50.01 v45.54,50.01
D7  (via drill 0.35)
  Top 0.203: 6532.27 68.8,58.71 68.8,62.62 67.7,63.72 62.22,63.72 60.35,61.85 X1.18 | v49.64,60.39 50.62,59.41 50.62,56.29 52.17,54.74 52.17,52.01 49.74,49.58 49.03,49.58 48.39,48.94 48.39,47.8 47.78,47.19 v47.45,47.19 | v44,40.14 45.54,38.61 6507.19
  Bottom 0.203: v49.64,60.39 50.63,61.37 50.63,62.29 51.69,63.35 57.81,63.35 X1.18 | v47.45,47.19 47.45,46.78 48.06,46.17 48.06,42.8 48.06,40.69 6507.19 | TIA.33 25.28,34.54 26.25,35.51 27.94,35.51 33.48,41.05 43.18,41.05 43.18,40.96 v44,40.14
D8  (via drill 0.35)
  Top 0.203: 6532.26 75.76,52.32 69.21,58.88 69.21,62.79 67.87,64.13 60.09,64.13 57.81,61.85 X1.16 | v55.02,60.09 55.3,59.82 55.3,56.24 53.39,54.33 53.39,51.44 47.37,45.42 v47.37,45.21
  Bottom 0.203: v55.02,60.09 X1.16 | v47.37,45.21 47.37,44.31 47.6,44.09 47.6,42.77 6507.18 44.28,39.46 43.72,39.46 42.54,40.64 33.65,40.64 28.99,35.98 28.99,33.85 28.11,32.97 26.25,32.97 25.28,32 TIA.34
GND  (via drill 0.35)
  Top 0.203: v55.32,20.8 59.17,20.8 59.59,21.23 | 59.59,21.23 60.15,21.79 62.27,21.79 62.84,21.23 62.84,20.43 61.21,18.8 6507.2 | 59.59,21.23 59.59,23.77 60.2,24.38 C16.2 | v6.1,29.46 1.78,33.78 v1.78,35.05 | JOY_LFT.8 78.91,74.3
  Top 0.254: 78.91,74.3 77.82,75.39 76.92,75.39 76.28,74.75 76.28,73.84 77.65,72.47 77.65,71.3 78.29,70.66 79.45,70.66 v80.77,69.34
  Bottom 0.203: IC1.7 55.2,20.93 v55.32,20.8 | C5.2 6.35,33.65 7.41,32.59 7.41,30.77 v6.1,29.46 | v1.78,35.05 1.78,35.01 COLOR.3
  other vias: 58.67,78.44 67.63,24.38 2.03,22.93
  pour Top: -0.64,3.17 -0.64,2.54 arc90 2.54,-0.64 96.52,-0.64 arc90 100.33,3.17 100.33,82.55 arc90 97.16,85.72 2.54,85.72 arc90 -0.64,82.55
  pour Bottom: -1.27,1.91 arc90 1.91,-1.27 2.54,-1.27 96.52,-1.27 arc90 100.97,3.17 100.97,82.55 arc90 97.16,86.36 2.54,86.36 arc90 -1.27,82.55
LFT_JOY_DWN  (via drill 0.35)
  Top 0.203: 6532.13 94.59,48.87 94.59,51.35 95,51.76 95,53.21 95.4,53.61 95.4,68.07 94.16,69.31 92.92,69.31 92.67,69.06 84.36,69.06 83.12,70.31 83.12,71.09 82.83,71.38 v82.83,71.77
  Bottom 0.203: v82.83,71.77 82.55,72.04 82.55,72.2 81.92,72.82 77.06,72.82 JOY_LFT.2
LFT_JOY_LFT  (via drill 0.35)
  Top 0.203: 6532.14 92.96,50.3 94.59,51.92 94.59,53.38 95,53.78 95,67.9 93.99,68.91 93.09,68.91 92.84,68.66 84.19,68.66 82.43,70.42 v82.43,70.81
  Bottom 0.203: v82.43,70.81 82.04,70.81 81.92,70.69 79.81,70.69 JOY_LFT.3
LFT_JOY_RGT
  Top 0.203: 6532.15 94.59,53.95 94.59,67.73 93.82,68.5 93.25,68.5 93,68.25 84.02,68.25 81.48,70.79 JOY_LFT.4
LFT_JOY_UP  (via drill 0.35)
  Top 0.203: 6532.12 94.59,46.33 94.59,48.3 95,48.7 95,51.18 95.4,51.59 95.4,53.04 95.81,53.45 95.81,68.24 94.33,69.72 92.75,69.72 92.5,69.47 84.92,69.47 v83.98,70.41
  Bottom 0.203: v83.98,70.41 83.26,70.41 83.01,70.41 82.72,70.12 74.89,70.12 JOY_LFT.1
LFT_PADDLE_A  (via drill 0.35)
  Top 0.203: v7.72,36.68 7.78,36.63 8,36.63 8,34.04 6.46,32.5 6.07,32.5 5.67,32.1 5.67,31.53 6.07,31.13 6.07,31.03 7.18,29.91 7.18,27.25 6.41,26.47 6.41,25.91 10.44,21.87 10.44,20.93 TIA.39 | JOY_LFT.9 80.92,76.22 73.84,76.22 73.39,76.68 70.94,76.68 70.83,76.8 70.83,77.24 70.43,77.64 69.86,77.64 69.31,77.09 65.23,77.09 63.3,79.02 63.3,79.03 62.81,79.51 62.81,80.57 62.26,81.12 61.69,81.12 61.67,81.1 21.45,81.1 15.6,75.25 15.6,72.76 15.04,72.2 15.04,71.31 15.66,70.69 16.74,70.69 16.97,70.46 16.97,68.33 16.66,68.02 10.02,68.02 7.59,65.6 7.59,38.09 6.63,37.13 6.63,36.88 v6.36,36.6
  Bottom 0.203: JOY_LFT.9 83.75,74.3 C8.1 | v6.36,36.6 7.65,36.6 v7.72,36.68
LFT_PADDLE_B
  Top 0.203: JOY_LFT.5 83.84,71.75 81.18,74.42 81.18,74.74 80.1,75.82 73.68,75.82 73.22,76.28 17.8,76.28 16.41,74.88 16.41,73.85 17.37,72.89 17.37,68.16 16.82,67.61 10.19,67.61 8,65.43 8,37.92 7.04,36.96 7.04,36.4 7.59,35.84 7.59,34.6 5.26,32.27 5.26,31.27 6.78,29.75 6.78,27.42 6,26.64 6,25.74 10.03,21.7 10.03,19.31 12.06,17.28 TIA.40
  Bottom 0.203: JOY_LFT.5 84.23,71.13 84.66,70.69 84.66,70.13 84.26,69.73 83.1,69.73 C9.1
N$1  (via drill 0.35)
  Top 0.305: v34.66,20.73 32.77,18.84 R1.2
  Bottom 0.305: R1.2 30.14,17.21 28.55,18.8 27.81,18.8 TIA.2 | R6.2 36.38,21.46 36.38,21.41 35.98,21.01 35.63,21.01 35.36,20.73 v34.66,20.73
  other vias: 32.77,17.21
N$2  (via drill 0.35)
  Top 0.254: v32.57,26.64 27.59,26.64 TIA.5
  Bottom 0.254: R2.2 32.93,26.64 v32.57,26.64
  Bottom 0.305: R2.2 R7.2
N$3  (via drill 0.35)
  Top 0.305: R3.2 30.29,32 TIA.7
  Bottom 0.254: R8.2 R3.2
  other vias: 35.37,26.92
N$4  (via drill 0.35)
  Top 0.305: TIA.8 29.34,32.51 30.5,32.51 33.8,29.21 R4.2
  Bottom 0.305: R9.2 39.37,31.31 R4.2
  other vias: 37.27,29.21
N$5  (via drill 0.35)
  Top 0.305: TIA.9 27.3,36.64 28.98,34.97 28.98,34.75 34.02,29.72 35.49,29.72 R5.2
  Bottom 0.305: C1.1 R5.2
  other vias: 37.27,31.5
N$6
  Bottom 0.305: R11.2 R10.2 C1.2
N$7
  Bottom 0.305: R11.1 37.34,38.29 C2.1
N$8
  Bottom 0.305: C2.2 R9.1 40.26,33.33 40.32,33.33 40.53,33.12 40.53,31.53 40.32,31.32 40.1,31.32 38.28,29.5 38.28,25.98 37.27,24.97 R8.1 37.27,24.3 38.28,23.3 38.28,21.41 36.87,20 R19.2 34.36,20 33.53,20.83 33.53,22.67 R7.1 33.85,22.35 R6.1
N$9  (via drill 0.35)
  Top 0.203: C5.1 8.41,33.87 8.41,65.12 10.5,67.21 16.99,67.21 17.78,68 17.78,73.99 RIGHT.6
  Bottom 0.203: R14.1 4,29.85 R13.2 C5.1
  other vias: 6.35,31.82
N$10  (via drill 0.35)
  Top 0.203: JOY_LFT.6 73.05,75.87 25.77,75.87 24.64,74.74 24.64,73.57 23.27,72.2 23.27,68.61 21.46,66.8 10.67,66.8 8.81,64.95 8.81,28.96 8.81,27.92 v7.09,26.19
  Bottom 0.203: v7.09,26.19 5.14,26.19 4.77,25.82 3.48,25.82 3.2,25.82 R16.2 2.1,24.89 C4.1 2.03,24.76 3.09,23.7 3.09,22.15 2.03,21.09 R15.1
N$11
  Bottom 0.305: R16.1 TIA.36
N$12
  Bottom 0.254: TIA.35 10.01,27.41 5.43,27.41 4.5,28.33 3.21,28.33 3.02,28.53 3.02,28.54 2.19,29.37
  Bottom 0.305: 2.19,29.37 R13.1
N$13
  Bottom 0.813: BRIGHT.2 36.76,13.06 36.58,13.24 R19.1 37.24,17.43 T4.2
N$14
  Bottom 0.813: R21.1 R20.2 42.35,12.58 BRIGHT.1 37.15,10.44 T1.B
N$15
  Bottom 0.813: R22.1 41.42,4.06 T1.E
N$16  (via drill 0.35)
  Top 0.813: R23.2 31.26,4.23 T1.C
  Bottom 0.813: T1.C 34.32,4.23 T2.1
  other vias: 28.89,6.6 38.1,4.23
N$17
  Bottom 0.305: COLOR.2 3.39,39.62 9.97,39.62 10.98,38.61 13.15,38.61 14.16,39.62 TIA.10
N$18  (via drill 0.35)
  Top 0.203: v71.37,72.69 71.1,72.42 70.68,72.42 70.28,72.02 70.28,67.7 v69.82,67.24 | v61.98,80.44 61.98,78.59 S3.1
  Bottom 0.203: v69.82,67.24 69.82,66.85 69.81,66.84 69.81,64.42 70.8,63.44 | v71.37,72.69 71.09,72.96 71.09,75.05 68.21,77.93 64.79,77.93 63.7,79.01 63.7,79.19 62.46,80.44 v61.98,80.44 | 70.8,63.44 | 70.8,63.44 70.8,57.66 71.12,57.34
  Bottom 0.305: 6532.24 71.12,57.34 C10.1
N$19  (via drill 0.35)
  Top 0.203: v70.5,66.56 70.77,66.84 70.77,66.85 70.97,67.04 v70.97,71.74
  Bottom 0.203: 6532.23 73.95,63.72 71.09,63.72 70.69,64.12 70.69,66.36 v70.5,66.56 | v70.97,71.74 70.69,72.01 70.69,74.88 68.04,77.52 64.62,77.52 63.3,78.84 63.3,79.03 62.57,79.76 55.03,79.76 54.3,79.03 54.3,78.66 53.16,77.52 46.05,77.52 45.06,78.51 S4.1
N$20  (via drill 0.35)
  Top 0.305: v71.37,64.4 JP1.1
  Bottom 0.305: 6532.21 71.99,65.02 v71.37,64.4
N$21  (via drill 0.35)
  Top 0.203: v71.45,66.57 71.73,66.84 71.73,66.86 74.27,69.39 79.55,69.39 81.16,67.79 81.16,67.64 v81.44,67.36
  Bottom 0.203: v71.45,66.57 69.14,68.89 61.68,68.89 LDIFF.2 | 6532.17 90.61,57.4 84.2,63.81 84.2,64.6 v81.44,67.36
N$22  (via drill 0.35)
  Top 0.203: v80.48,67.5 80.08,67.5 78.6,68.99 74.83,68.99 v72.42,66.57
  Bottom 0.203: v80.48,67.5 80.48,67.35 83.79,64.04 83.79,63.65 92.57,54.86 6532.16 | v72.42,66.57 69.66,69.33 62.65,69.33 62.33,69.65 62.33,70.25 61.77,70.81 61.34,70.81 60.71,71.45 RDIFF.2
N$23  (via drill 0.35)
  Top 0.305: v64.91,13.59 JP2.1
  Bottom 0.254: v64.91,13.59 66.12,14.8 R18.2
  Bottom 0.305: 6507.1 63.37,13.59 v64.91,13.59
N$24
  Bottom 0.813: T2.2 31.04,3.05 R24.2
N$25
  Bottom 0.813: T2.3 30.23,9.48 R25.1 23.4,10.99 21.75,12.64 17.46,12.64 VIDEO.1
N$26
  Bottom 0.254: C3.2 R26.2
N$27
  Bottom 0.203: TIA.13 31.27,47.24
  Bottom 0.254: 31.27,47.24 33.11,49.09 C3.1 | TIA.13 TIA.12
  Bottom 0.305: C3.1 R12.2
N$28  (via drill 0.35)
  Top 0.254: C11.1 40.7,44.2 v40.7,38.78
  Bottom 0.203: v40.7,38.78 42.88,36.6 42.88,14.4 44.95,12.33 51.09,12.33 53,10.41 AUDIO.1
  Bottom 0.305: R26.1 C11.1
  other vias: 38.35,46.54
N$29
  Bottom 0.305: C18.1 R27.2 77.54,31.82 6532.34
N$30
  Bottom 0.305: Q1.2 3.17,66.23 | 3.17,66.23 C20.1 | R28.2 4.06,67.12 3.17,66.23
N$31
  Bottom 0.305: 4.32,50.36 C19.1 R29.2 | 4.32,50.36 R30.2 | 4.32,50.36 4.32,56.01 Q1.1
N$32
  Bottom 0.203: TIA.11 14.09,42.16 13.12,41.2 10.68,41.2 R31.2
  Bottom 0.305: R28.1 5.97,68.13 6.03,68.13 7.25,66.9 7.25,46.89 7.04,46.68 6.43,46.68 6.1,46.34 R31.2 R29.1 2.54,45.53 T3.3
N$33  (via drill 0.35)
  Top 0.305: T3.1 6.1,47.92 R30.1
  other vias: 1.59,43.42 6.1,52.26
N$34
  Bottom 0.203: R17.1 40.62,16.94 T4.3
N$35  (via drill 0.35)
  Top 0.203: v55.32,19.71 56.01,19.02 57.2,19.02 57.6,18.62 57.6,18.06 56.92,17.38 IC1.12 55.05,17.72 54.54,17.72 54.48,17.66 53.91,17.66 53.85,17.72 v53.46,17.72
  Bottom 0.203: v55.32,19.71 55.6,19.98 55.6,20.12 56.41,20.93 IC1.8 | IC1.13 IC1.12 | IC1.5 52.79,18.39 v53.46,17.72
  other vias: 56.92,15.85
N$36  (via drill 0.35)
  Top 0.203: v54.2,18.34 53.11,19.43 53.11,21.45 D3.A
  Bottom 0.203: IC1.2 51.41,15.21 51.92,15.21 54.2,17.5 v54.2,18.34
  other vias: 55.12,23.45
N$37  (via drill 0.35)
  Bottom 0.203: 3.56,10.01 v7.37,6.2
N$38
  Bottom 0.203: IC1.3 IC1.4
N$39  (via drill 0.35)
  Top 0.203: v53.8,19.71 55.16,18.34 v56.92,18.34
  Bottom 0.203: v53.8,19.71 53.75,19.66 IC1.6 50.6,19.66 49.96,20.3 49.63,20.3 48.78,21.15 48.78,26.61 50.03,27.85 D1.A | v56.92,18.34 IC1.10
N$40  (via drill 0.35)
  Top 0.203: v56.92,19.71 57.2,19.43 57.37,19.43 58.92,17.88 v58.92,17.66 | R33.1 26.04,18.54 26.7,17.88 29.31,17.88 32.41,14.78 47.03,14.78 48.01,15.76 48.01,20.66 D1.C | v55.37,13.95 v52.43,13.95
  Bottom 0.203: D2.C 21.27,18.69 R33.1 | D1.C 52.69,21.57 58.06,21.57 58.24,21.39 58.24,20.47 58.06,20.3 57.56,20.3 IC1.9 v56.92,19.71 | IC1.1 51.41,13.95 v52.43,13.95 | v58.92,17.66 58.24,16.98 58.24,14.12 58.06,13.95 v55.37,13.95
  other vias: 50.8,23.45 21.27,18.54
P_SW  (via drill 0.35)
  Top 0.203: 55.12,27.96 D3.C v55.12,33.1 55.12,27.96 | v43.1,62.77 43.1,62.38 42.6,61.88 42.6,55.9 42.05,55.35 42.05,43.7 43.64,42.11 48.76,42.11 v53.02,37.85 | v58.06,24.81 53.99,24.81 49.05,19.86 49.05,14.58 48.03,13.56 v42.75,13.56 | v58.44,26.59 56.49,26.59 55.12,27.96
  Bottom 0.203: PAUSE.2 46.25,69.37 | 46.25,69.37 46.25,69.3 R34.2 | v43.1,62.77 45.09,64.75 45.09,68.2 46.25,69.37 | T4.1 40.78,15.54 v42.75,13.56 | v58.06,24.81 58.06,26.21 v58.44,26.59 | v55.12,33.1 55.12,35.76 v53.02,37.85
  other vias: 55.12,27.85
PHI_0
  Top 0.203: TIA.4 34.26,24.38 38.04,20.6 38.04,20.21 38.79,19.46 44.81,19.46 6507.27
PHI_2
  Top 0.203: 13.16,35.71 10.84,35.71 10.03,36.52 10.03,50.29 TIA.26 | 6507.28 47.6,17.37 47.6,18.69 46.46,19.83 46.46,19.86 40.32,19.86 31.68,28.5 26.25,28.5 26.15,28.59 25.68,29.06 25.68,30.45 19.86,36.27 13.85,36.27 13.29,35.71 13.16,35.71 | 13.16,35.71
  Bottom 0.203: 6532.39 58.34,19.3 58.06,19.02 49.63,19.02 49.45,18.85 49.45,17.3 47.9,15.75 6507.28
R/W  (via drill 0.35)
  Top 0.203: v25.02,28.76 25.68,28.1 25.68,26.52 26.25,25.96 33.26,25.96 v38.73,20.49 | 6507.26 45.88,20.74 v40.92,20.74 | v56.9,27.27 58.16,27.27 v58.83,27.94 | TIA.25 13.69,53.24 13.69,38.46 14.38,37.77 v14.66,37.77 | v15.75,30.73 15.75,33.56 v15.44,33.86
  Bottom 0.203: 6532.35 73.39,29.46 70.47,26.54 68.72,26.54 65.8,29.46 60.35,29.46 60.3,29.41 60.15,29.41 59.59,28.85 59.59,28.7 v58.83,27.94 | v25.02,28.76 23.66,28.76 22.4,30.02 16.46,30.02 v15.75,30.73 | v38.73,20.49 38.97,20.74 v40.92,20.74 | v14.66,37.77 14.66,35.92 14.24,35.51 11.01,35.51 10.44,34.94 10.44,34.14 11.01,33.58 13.12,33.58 13.41,33.86 v15.44,33.86 | 6507.26 46.32,20.83 48.37,22.89 48.37,26.77 49.3,27.7 49.3,29.18 49.47,29.36 49.48,29.36 49.58,29.46 52.02,29.46 52.3,29.18 52.3,27.84 54.69,25.45 56.34,25.45 56.9,26.01 v56.9,27.27
RGT_JOY_DWN  (via drill 0.35)
  Top 0.203: v83.49,61.84 79.1,61.84 78.78,61.52 71.81,61.52 68.32,65.01 68.32,66.47 62.33,72.46 62.33,74.82 61.77,75.39 60.81,75.39 60.73,75.46 36.64,75.46 v36.37,75.19 | v33.78,77.77 33.51,77.5 25.49,77.5 24.94,78.05 24.03,78.05 23.35,77.37 22.12,77.37 21.85,77.64 21.28,77.64 20.6,76.96 v18.85,76.96 | v18.87,74.12 18.87,71.78 RIGHT.2
  Bottom 0.203: 6532.9 91.34,38.71 91.34,40.67 90.93,41.08 90.93,43.56 90.53,43.97 90.53,55.19 83.88,61.84 v83.49,61.84 | v36.37,75.19 v33.78,77.77 | v18.85,76.96 18.85,74.14 v18.87,74.12
RGT_JOY_LFT  (via drill 0.35)
  Top 0.203: v83.1,62.79 82.24,63.65 72.49,63.65 72.16,63.31 70.59,63.31 68.73,65.18 68.73,69.41 v68.12,70.01 | v63.81,77.37 63.53,77.09 25.32,77.09 24.77,77.64 24.2,77.64 23.52,76.96 v21.57,76.96
  Bottom 0.203: 6532.10 91.34,41.25 91.34,43.73 90.93,44.14 90.93,55.35 83.49,62.79 v83.1,62.79 | v68.12,70.01 70.28,72.17 70.28,74.71 67.88,77.11 64.06,77.11 v63.81,77.37 | v21.57,76.96 21.57,71.78 RIGHT.3
RGT_JOY_RGT  (via drill 0.35)
  Top 0.203: v71.79,73.62 71.54,73.37 71.06,73.37 69.13,71.45 69.13,65.35 70.76,63.72 71.99,63.72 72.33,64.06 82.8,64.06 v83.11,63.75 | v70.15,76.96 69.87,76.68 24.76,76.68 v24.49,76.96
  Bottom 0.203: 6532.11 92.96,42.68 91.34,44.3 91.34,55.52 89.94,56.92 v83.11,63.75 | v71.79,73.62 71.5,73.92 71.5,75.21 70.15,76.57 v70.15,76.96 | v24.49,76.96 24.33,76.81 RIGHT.4
RGT_JOY_UP  (via drill 0.35)
  Top 0.203: v83.67,60.88 83.43,61.11 71.64,61.11 67.92,64.84 67.92,66.3 60.76,73.46 52.03,73.46 50.43,75.06 37.59,75.06 v37.31,74.78 | v34.74,77.78 34.47,78.05 34.47,78.06 34.06,78.45 33.5,78.45 32.95,77.9 25.66,77.9 25.11,78.45 23.87,78.45 23.18,77.77 22.29,77.77 22.02,78.05 21.11,78.05 20.49,77.43 19.35,77.43 19.13,77.64 18.56,77.64 16,75.08 16,73.69 16.1,73.58 RIGHT.1
  Bottom 0.203: 6532.8 90.93,36.58 90.93,40.51 90.53,40.91 90.53,43.39 90.12,43.8 90.12,55.02 84.26,60.88 v83.67,60.88 | v37.31,74.78 37.05,75.05 37.05,75.47 v34.74,77.78
RGT_PADDLE_A
  Top 0.203: TIA.37 12.06,24.9 9.63,27.34 9.63,64.61 11.01,65.99 22.02,65.99 25.7,69.67 RIGHT.9
  Bottom 0.203: RIGHT.9 25.7,73.82 26.71,72.82 27.52,72.82 28.14,72.2 28.14,71.38 C7.1
RGT_PADDLE_B  (via drill 0.35)
  Top 0.203: TIA.38 12.06,22.36 10.44,23.98 10.44,25.95 9.22,27.17 9.22,64.78 10.84,66.4 21.85,66.4 25.02,69.56 v25.02,70.42
  Bottom 0.203: v25.02,70.42 25.74,70.42 RIGHT.5 27.64,71.19 C6.1
TIA_RDY
  Bottom 0.203: TIA.3 D2.A 22.52,25.63 R32.2
VBUS
  Bottom 0.406: USB1.1 86.52,5.84
  Bottom 0.508: 86.52,9.48 86.52,9.81 81.94,9.81 SV1.1 | 86.52,9.48 ON/OFF.1 | 86.52,5.84 86.52,9.48
(copper drawn outside any net)
  shapes: Bottom area x52

### Text on the board
tNames: RIGHT / PLAYER | LEFT / PLAYER | ADDRESS / BUS | DATA BUS | BW/ / COLOR | A7 | +5V | GND | +5V | A8 | A9 | A11 | A10 | A12 | D8 | D7 | D6 | D5 | D4 | +5V | B/W | GND | PB2 | D6 | BUTTONS | PB4 | CS1 | D5 | SELECT | PB5 | SWITCHES | A12 | START | D4 | LEFT / DIFF. | Atari Television Interface Adapter | R/W | D3 | IRQ | A7 | A6 | A5 | A4 | A3 | A2 | A1 | A0 | D1 | D2 | D3 | GND | RIGHT / DIFF. | PHI2 | D8 | D2 | RGT | ADDRESS BUS | DATA BUS | A5 | D1 | DATA BUS | D7 | LFT | A10 | A9 | A4 | AUDIO | D6 | AU2 | A11 | DWN | A8 | A3 | D5 | AU1 | A12 | UP | LEFT JOYSTICK | A2 | ADDRESS BUS | A7 | D4 | CLK | D8 | RGT | MOS Technologies / 6507 Microprocessor | A6 | A1 | D3 | DEL | VIDEO | D7 | LFT | A5 | ADDRESS BUS | A0 | COL | D2 | DWN | D6 | A4 | D7 | DATA BUS | D1 | LM0 | D5 | UP | RIGHT JOYSTICK | A3 | DATA / BUS | D8 | LM2 | A5 | A0 | D4 | A2 | RIGHT / FIRE | R/W | BLK | D3 | A1 | LEFT / FIRE | A1 | LM1 | A9 | A2 | BUTTONS | D2 | A0 | ADDRESS BUS | RIGHT / PADDLE A | A12 | PHI0 | D1 | A3 | RIGHT / PADDLE B | DATA BUS | +5V | RDY | A7 | A4 | R/W | RDY | LEFT / PADDLE A | PHI2 | SYNC | PHI0 | A5 | LEFT / PADDLE B | GND | MOS Technologies 6532 RIOT Chip | ADDRESS BUS | PADDLES | GND | ADDRESS BUS | A6 | GND | PHI2 | RES | RESET | GND | GND | +5V | Use at least / 500mA Supply
bNames: BW/ / COLOR | A7 | Atari Television Interface Adapter | +5V | GND | +5V | A8 | A9 | A11 | A10 | A12 | D8 | D7 | D6 | D5 | D4 | +5V | GND | PB2 | D6 | PB4 | CS1 | D5 | SELECT | PB5 | A12 | START | D4 | LEFT / DIFF. | R/W | D3 | IRQ | A7 | A6 | A5 | A4 | A3 | A2 | A1 | A0 | D1 | D2 | D3 | GND | RIGHT / DIFF. | PHI2 | D8 | D2 | RGT | A5 | D1 | D7 | LFT | A10 | MOS Technologies / 6507 Microprocessor | A9 | A4 | D6 | AU2 | A11 | DWN | A8 | A3 | D5 | AU1 | A12 | UP | A2 | A7 | D4 | CLK | D8 | RGT | A6 | A1 | D3 | DEL | D7 | LFT | A5 | A0 | COL | D2 | DWN | D6 | A4 | D7 | D1 | LM0 | D5 | UP | A3 | D8 | LM2 | A5 | A0 | D4 | A2 | RIGHT / FIRE | This was a cost reduced version of / the very popular 6502 processor | R/W | BLK | D3 | A1 | LEFT / FIRE | This chip was custom manufactured by Atari and is responsible for / drawing everything on the screen, producing sound, and reading some / controller input. It's considered by many to be the soul of the system | A1 | LM1 | A9 | A2 | D2 | A0 | RIGHT / PADDLE A | A12 | PHI0 | D1 | A3 | RIGHT / PADDLE B | +5V | RDY | A7 | A4 | R/W | RDY | LEFT / PADDLE A | PHI2 | SYNC | PHI0 | A5 | LEFT / PADDLE B | GND | GND | A6 | GND | PHI2 | This chip serves two functions; It holds the system's 128 bytes of RAM and gives the CPU / more I/O so it can connect with all the controllers and difficulty switches. | MOS Technologies 6532 RIOT Chip | RES | GND | GND | +5V